# Altium schematic sheet ADC1.SchDoc
size 149 x 100 mm; SheetNumber: 2; SheetTotal: 13
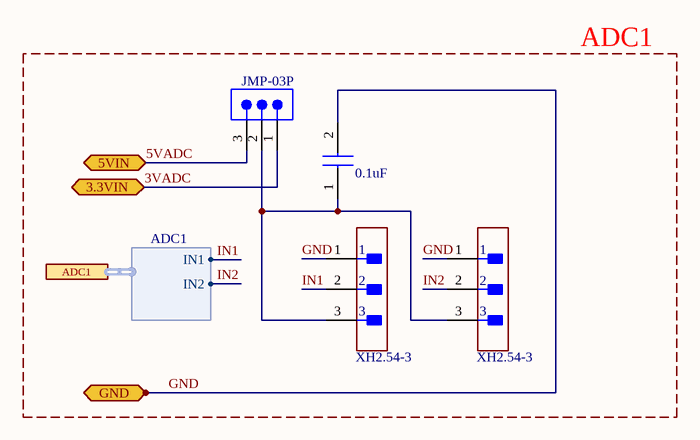
[diagram p0: ADC1.SchDoc]

## Parts
ADC1-1  XH2.54-3  [XH2.54-3]
ADC1-2  XH2.54-3  [XH2.54-3]
CAPADC  0.1uF  [CAP0805]
JMPADC1  JMP-03P  [JMP-03P]

## Blocks framed on the sheet
ADC1: ADC1-1 ADC1-2 CAPADC JMPADC1

## Ports
3.3VIN (bidir, see CONTROL_PCB_MAIN[3D], I2C[2A], I_O[1A], MOTORS[2B], RELAY_5V_3.3V_LEVEL[3B], SPI[1A], UARTSTM[2A]), 5VIN (bidir, see CONTROL_PCB_MAIN[3D], I2C[2A], I_O[1A], LEDS[1A], MOTORS[2B], RELAY_5V_3.3V_LEVEL[3B], SPI[1A], UARTSTM[2A]), ADC1 (harness ADC1, see CONTROL_PCB_MAIN[3D], STM32[2B]), GND (bidir, see CONTROL_PCB_MAIN[3D], CAN[2C], I2C[2D], I_O[1C], LEDS[1D], MOTORS[2D], RELAY_5V_3.3V_LEVEL[5C], RELAY_12VV_VDD_LEVEL[5B], SPI[1D], STM32[1D], UARTSTM[2D])

## Harnesses
ADC1: IN2, IN1

## Nets
3VADC: JMPADC1.1 ; port 3.3VIN
5VADC: JMPADC1.3 ; port 5VIN
GND: ADC1-1.1 ADC1-2.1 CAPADC.2 ; port GND
IN1: ADC1-1.2 ; port ADC1.IN1
IN2: ADC1-2.2 ; port ADC1.IN2
NetADC1-1_3: ADC1-1.3 ADC1-2.3 CAPADC.1 JMPADC1.2

## Library data of the parts
ADC1-1 ADC1-2 = XH2.54-3: JST XH2.54-3pin
CAPADC = CAP0805: CAP-SMD0805
JMPADC1 = JMP-03P: PLS-1x3